# Altium schematic sheet NO_Output_Processing.SchDoc
size A4
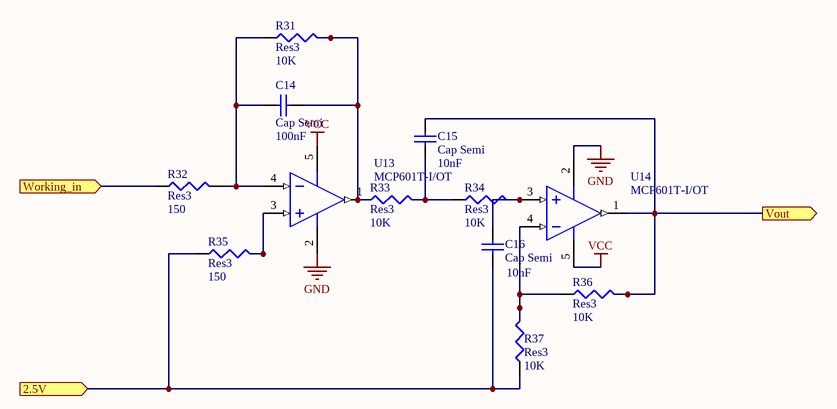
[diagram p0: NO_Output_Processing.SchDoc]

## Parts
C14  Cap Semi  value 100nF  [C1206]
C15  Cap Semi  value 10nF  [C1206]
C16  Cap Semi  value 10nF  [C1206]
R31  Res3  value 10K  [J1-0603]
R32  Res3  value 150  [J1-0603]
R33  Res3  value 10K  [J1-0603]
R34  Res3  value 10K  [J1-0603]
R35  Res3  value 150  [J1-0603]
R36  Res3  value 10K  [J1-0603]
R37  Res3  value 10K  [J1-0603]
U13  MCP601T-I/OT  [SOT-23-OT5_L]
U14  MCP601T-I/OT  [SOT-23-OT5_L]

## Ports
2.5V (in), Vout (out), Working_in (in)

## Nets
GND: U13.2(VSS) U14.2(VSS)
VCC: U13.5(VDD) U14.5(VDD)
2.5V: C16.1 R35.1 R37.1 ; port 2.5V
Vout: C15.2 R36.2 U14.1(VOUT) ; port Vout
Working_in: R32.1 ; port Working_in
NetC14_1: C14.1 R31.1 R32.2 U13.4(VIN-)
NetC14_2: C14.2 R31.2 R33.1 U13.1(VOUT)
NetC15_1: C15.1 R33.2 R34.1
NetC16_2: C16.2 R34.2 U14.3(VIN+)
NetR35_2: R35.2 U13.3(VIN+)
NetR36_1: R36.1 R37.2 U14.4(VIN-)

## Library data of the parts
C14-C16 = Cap Semi: Capacitor (Semiconductor SIM Model); Published: 8-Jun-2000; LatestRevisionDate: 29-May-2009; LatestRevisionNote: IPC-7351 Footprint Added.; PackageReference: C1206; Publisher: Altium Limited; PackageDescription: Chip Capacitor
R31-R37 = Res3: Resistor; Published: 8-Jun-2000; LatestRevisionDate: 29-May-2009; LatestRevisionNote: IPC-7351 Footprint Added.; PackageReference: J1-0603; Publisher: Altium Limited; PackageDescription: Chip Resistor
U13 U14 = CMP-0187-00433-2: 2.7V to 6.0V Single Supply CMOS Operational Amplifier, 5-Pin SOT-23, Industrial Temperature, Tape and Reel; Code_IPC: SOT23-5; ComponentLink3Description: Package Specification; RevisionNote: URLs added.; PackageReference: SOT-23-OT5; ComponentLink3URL: http://www.microchip.com/stellent/groups/techpub_sg/documents/packagingspec/en012702.pdf; ComponentLink1Description: Manufacturer URL; DatasheetVersion: revG, Dec-2007; PackageDescription: 5-Lead Plastic Small Outline Transistor (OT) [SOT-23]; PackageVersion: revBB, Aug-2009; ComponentLink2Description: Datasheet; ComponentLink1URL: http://www.microchip.com/; ComponentLink2URL: http://ww1.microchip.com/downloads/en/DeviceDoc/21314g.pdf